# Altium project PWMDriver.PrjPCB
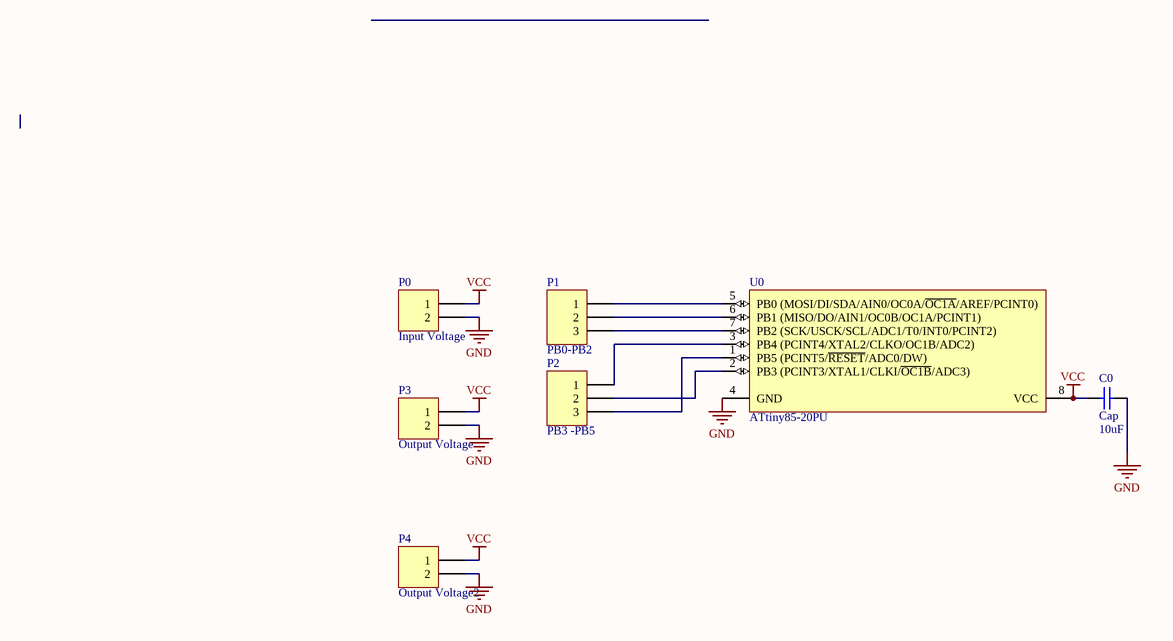
[diagram p0: PWMDriver.SchDoc]
1 sheet, 7 parts. Net scope: global (net labels, ports and power ports of the same name join across sheets).
Board file: PWMDriver.PcbDoc

## Sheet PWMDriver.SchDoc
size A4

### Parts
C0  Cap  value 10uF  [RAD-0.3]
P0  Input Voltage  [HDR1X2]
P1  PB0-PB2  [HDR1X3]
P2  PB3 -PB5  [HDR1X3]
P3  Output Voltage  [HDR1X2]
P4  Output Voltage2  [HDR1X2]
U0  ATtiny85-20PU  [8P3]

### Nets
GND: C0.2 P0.2 P3.2 P4.2 U0.4(GND)
VCC: C0.1 P0.1 P3.1 P4.1 U0.8(VCC)
NetP1_1: P1.1 U0.5(PB0_(MOSI/DI/SDA/AIN0/OC0A/~{OC1A}/AREF/PCINT0))
NetP1_2: P1.2 U0.6(PB1_(MISO/DO/AIN1/OC0B/OC1A/PCINT1))
NetP1_3: P1.3 U0.7(PB2_(SCK/USCK/SCL/ADC1/T0/INT0/PCINT2))
NetP2_1: P2.1 U0.3(PB4_(PCINT4/XTAL2/CLKO/OC1B/ADC2))
NetP2_2: P2.2 U0.2(PB3_(PCINT3/XTAL1/CLKI/~{OC1B}/ADC3))
NetP2_3: P2.3 U0.1(PB5_(PCINT5/~{RESET}/ADC0/DW))

### Library data of the parts
C0 = Cap: Capacitor; Published: 8-Jun-2000; LatestRevisionDate: 17-Jul-2002; LatestRevisionNote: Re-released for DXP Platform.; PackageReference: RAD-0.3; Publisher: Altium Limited; PackageDescription: Radial Cap, Thru-Hole; 2 Leads; 0.3 in Pin Spacing
P0 P3 P4 = Header 2: Header, 2-Pin; LatestRevisionDate: 17-Jul-2002; LatestRevisionNote: Re-released for DXP Platform.; Publisher: Altium Limited
P1 P2 = Header 3: Header, 3-Pin; LatestRevisionDate: 17-Jul-2002; LatestRevisionNote: Re-released for DXP Platform.; Publisher: Altium Limited
U0 = ATtiny85-20PU: Low Power tinyAVR® 8-Bit Microcontroller, 8K Flash Memory, 20MHz, Industrial Temperature, 8-Lead PDIP, Pb-Free; Published: 20-Nov-2009; DatasheetVersion: DOC2586I, May-2008; PackageVersion: revB, Jan-2002; PackageReference: 8P3; Publisher: Altium Limited; PackageDescription: 8-Lead, 0.300" Wide Body, Plastic Dual In-Line Package (PDIP); Supplier 1: Digi-Key; Supplier Part Number 1: ATTINY85-20PU-ND; Supplier 2: Farnell; Supplier Part Number 2: 1455162; Supplier 3: Mouser; Supplier Part Number 3: 556-ATTINY85-20PU; Code_JEDEC: MS-001-BA; ComponentLink1Description: Manufacturer Link; ComponentLink1URL: http://www.atmel.com/products/AVR/tinyavr.asp?; ComponentLink2Description: Datasheet; ComponentLink2URL: http://www.atmel.com/dyn/resources/prod_documents/doc2586.pdf; ComponentLink3Description: Atmel.com Home; ComponentLink3URL: http://www.atmel.com